# EAGLE design Stand_Alone_Inv_Adapter (EAGLE 6.2)
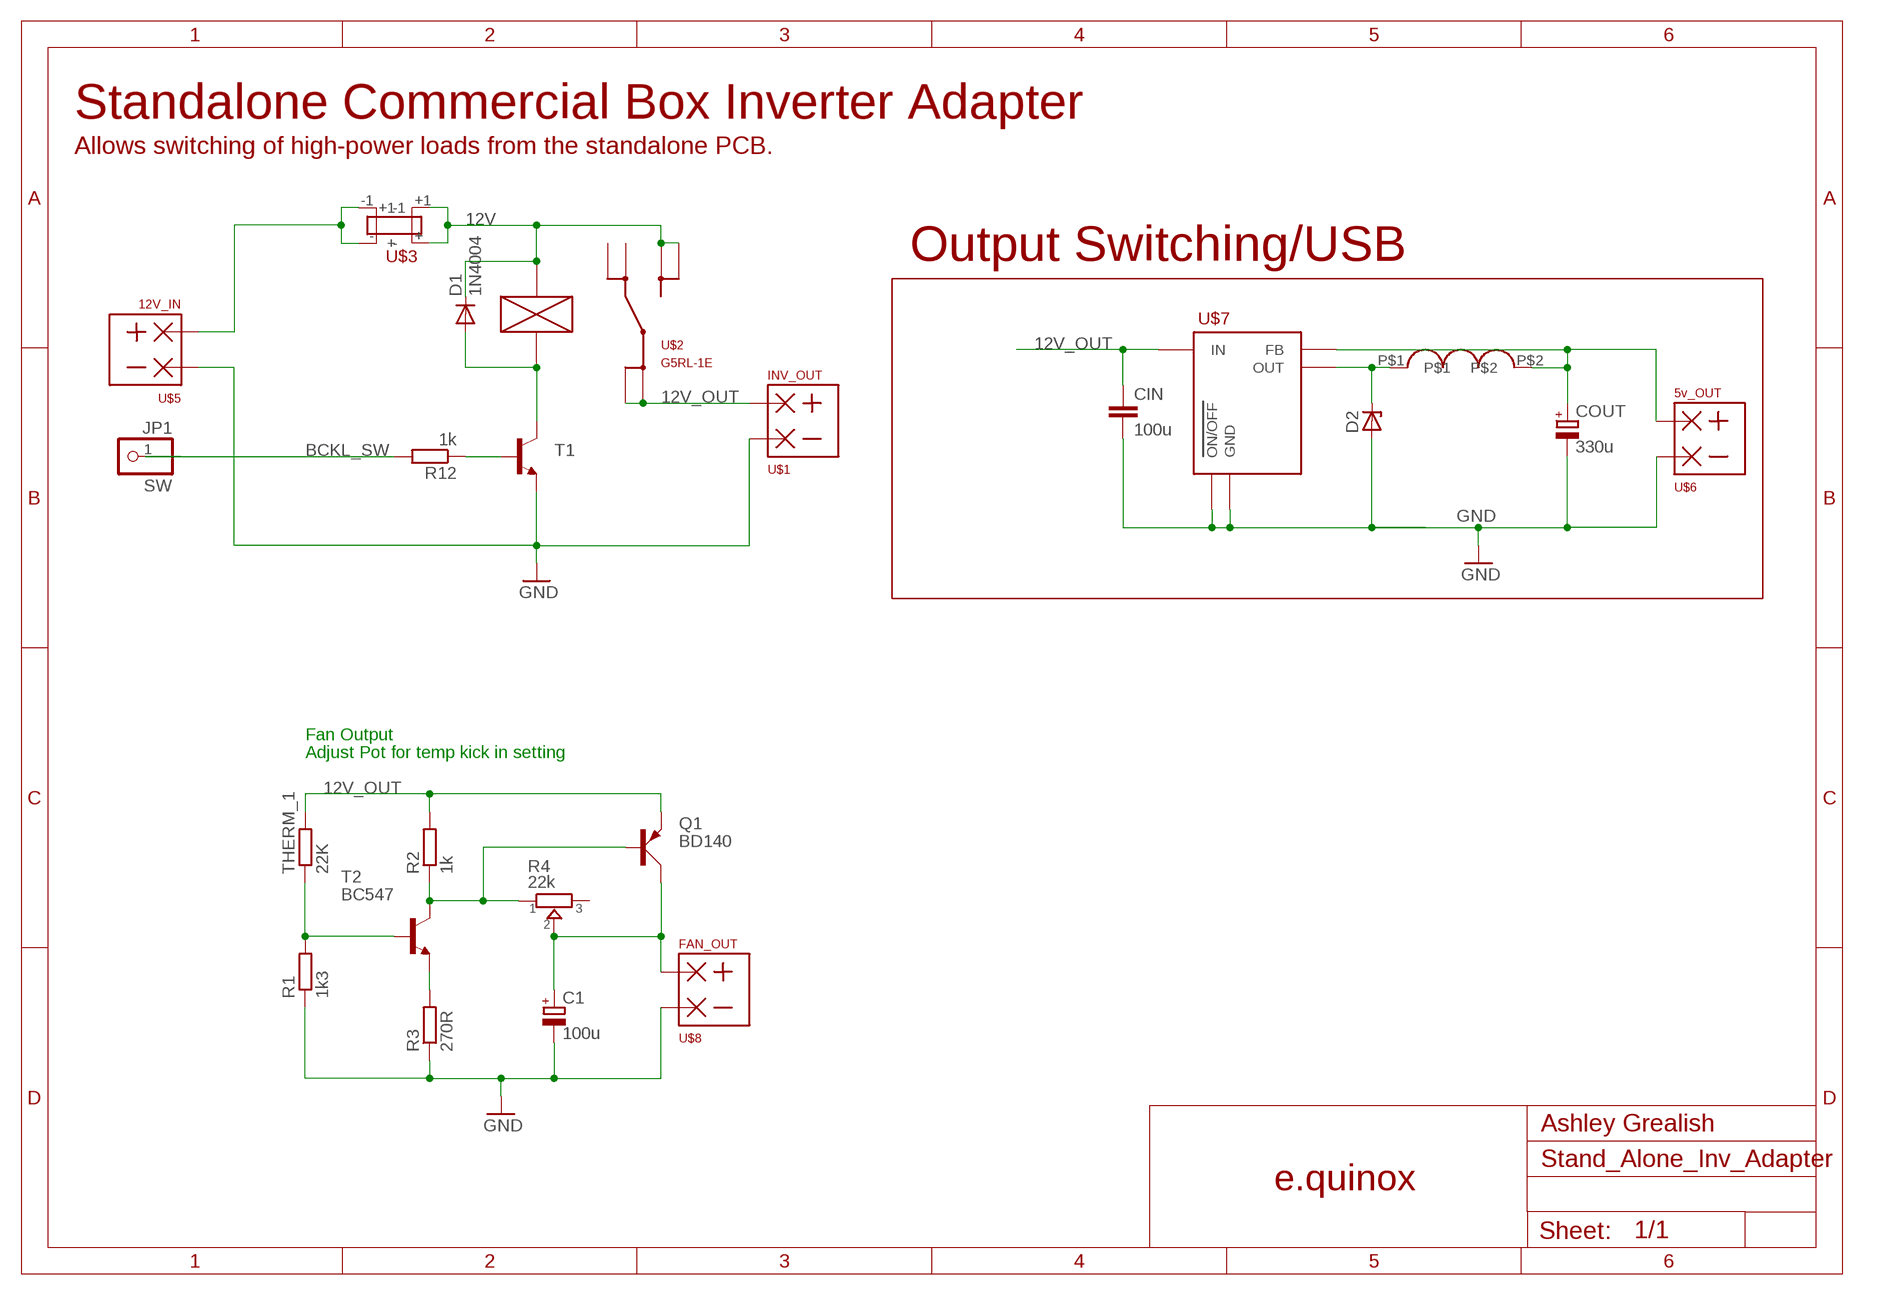
[diagram p0: schematic, sheet 1]

## Parts
C1  100u  CPOL-EUB45181B  [B45181B]
CIN  100u  C2.5/2  [C2.5-2]
COUT  330u  CPOL-EUB45181D  [B45181D]
D1  1N4004  [DO41-10]
D2  ZENER-DIODEDO41Z10  [DO41Z10]
JP1  SW  PINHD-1X1  [1X01]
Q1  BD140  [TO126AV]
R1  1k3  R-EU_0207/10  [0207/10]
R2  1k  R-EU_0207/10  [0207/10]
R3  270R  R-EU_0207/10  [0207/10]
R4  22k  TRIMMER-3362P  [TRIMMER_3362P]
R12  1k  RESISTOR-PTH-0.4  [RTH025W]
T1  BC546-NPN-TO92-CBE  [TO92-CBE]
T2  BC547  [TO92]
THERM_1  22K  R-EU_0204/7  [0204/7]
U$1  INV_OUT  TERMINAL_2WAY  [TERMINAL_2WAY]
U$2  G5RL-1E  [G5RL-1E]
U$3  EQBX_FUSEEQBX_FUSE  [EQBX_FUSE]
U$4  EQBX_INDUCTOR2  [INDUCTOR]
U$5  12V_IN  TERMINAL_2WAY  [TERMINAL_2WAY]
U$6  5v_OUT  TERMINAL_2WAY  [TERMINAL_2WAY]
U$7  LM2575  [TO220-5]
U$8  FAN_OUT  TERMINAL_2WAY  [TERMINAL_2WAY]

## Nets
12V [pow_12v]: D1.C U$2.COIL+ U$2.NO@1(NO) U$2.NO@2(NO) U$3.+ U$3.+1
12V_OUT [pow_12v]: CIN.1 Q1.E R2.2 THERM_1.2 U$1.P$1 U$2.COM@1(COM) U$2.COM@2(COM) U$7.P$1(IN)
BCKL_SW: JP1.1 R12.2
GND [pow_12v]: C1.- CIN.2 COUT.- D2.A R1.1 R3.1 T1.E U$1.P$2 U$5.P$2 U$6.P$2 U$7.P$3(GND) U$7.P$5(ON/OFF) U$8.P$2
N$1: D1.A T1.C U$2.COIL-
N$2: R12.1 T1.B
N$3 [pow_12v]: U$3.- U$3.-1 U$5.P$1
N$4: R1.2 T2.2(B) THERM_1.1
N$5: Q1.B R2.1 R4.1 T2.3(C)
N$6: R3.2 T2.1(E)
N$8: C1.+ Q1.C R4.2 U$8.P$1
N$27 [pow_5v]: COUT.+ U$4.P$2 U$6.P$1 U$7.P$4(FB)
N$30: D2.C U$4.P$1 U$7.P$2(OUT)
Unconnected: R4.3 U$2.NC@1(NC) U$2.NC@2(NC)

## Notes on the sheet
- Standalone Commercial Box Inverter Adapter
- Allows switching of high-power loads from the standalone PCB.
- Output Switching/USB
- Fan Output
- Adjust Pot for temp kick in setting
- Ashley Grealish
- e.quinox

## Library data of the parts
C1 COUT = resistor:CPOL-EU: POLARIZED CAPACITOR, European symbol
CIN = capacitor-wima:C: CAPACITOR naming: grid - package width
D1 = diode:1N4004: DIODE general purpose rectifier, 1 A
D2 = diode:ZENER-DIODE: Z-Diode
JP1 = pinhead:PINHD-1X1: PIN HEADER
Q1 = transistor-power:BD140: PNP TRANSISTOR
R1-R3 THERM_1 = resistor:R-EU_: RESISTOR, European symbol
R4 = dp_devices:TRIMMER: Trimmer resistor
R12 = dp_devices:RESISTOR
T1 = transistor:*-NPN-: NPN Transistror BF959 corrected 2008.03.06
T2 = transistor:BC547: NPN TRANSISTOR
U$1 U$5 U$6 U$8 = terminal_2way:TERMINAL_2WAY
U$2 = equinox:G5RL-1E
U$3 = eqbx_fuse:EQBX_FUSE
U$4 = inductor:EQBX_INDUCTOR2
U$7 = LM2575_TO220:LM2575

## Net classes
0 default: width 0.381 mm, drill 0.61 mm, clearance 0.381 mm
1 pow_5v: width 0.762 mm, drill 0.762 mm, clearance 0.762 mm
2 pow_12v: width 1.372 mm, drill 0.762 mm, clearance 0.762 mm
3 gnd: width 0.508 mm, drill 0.61 mm

## Board
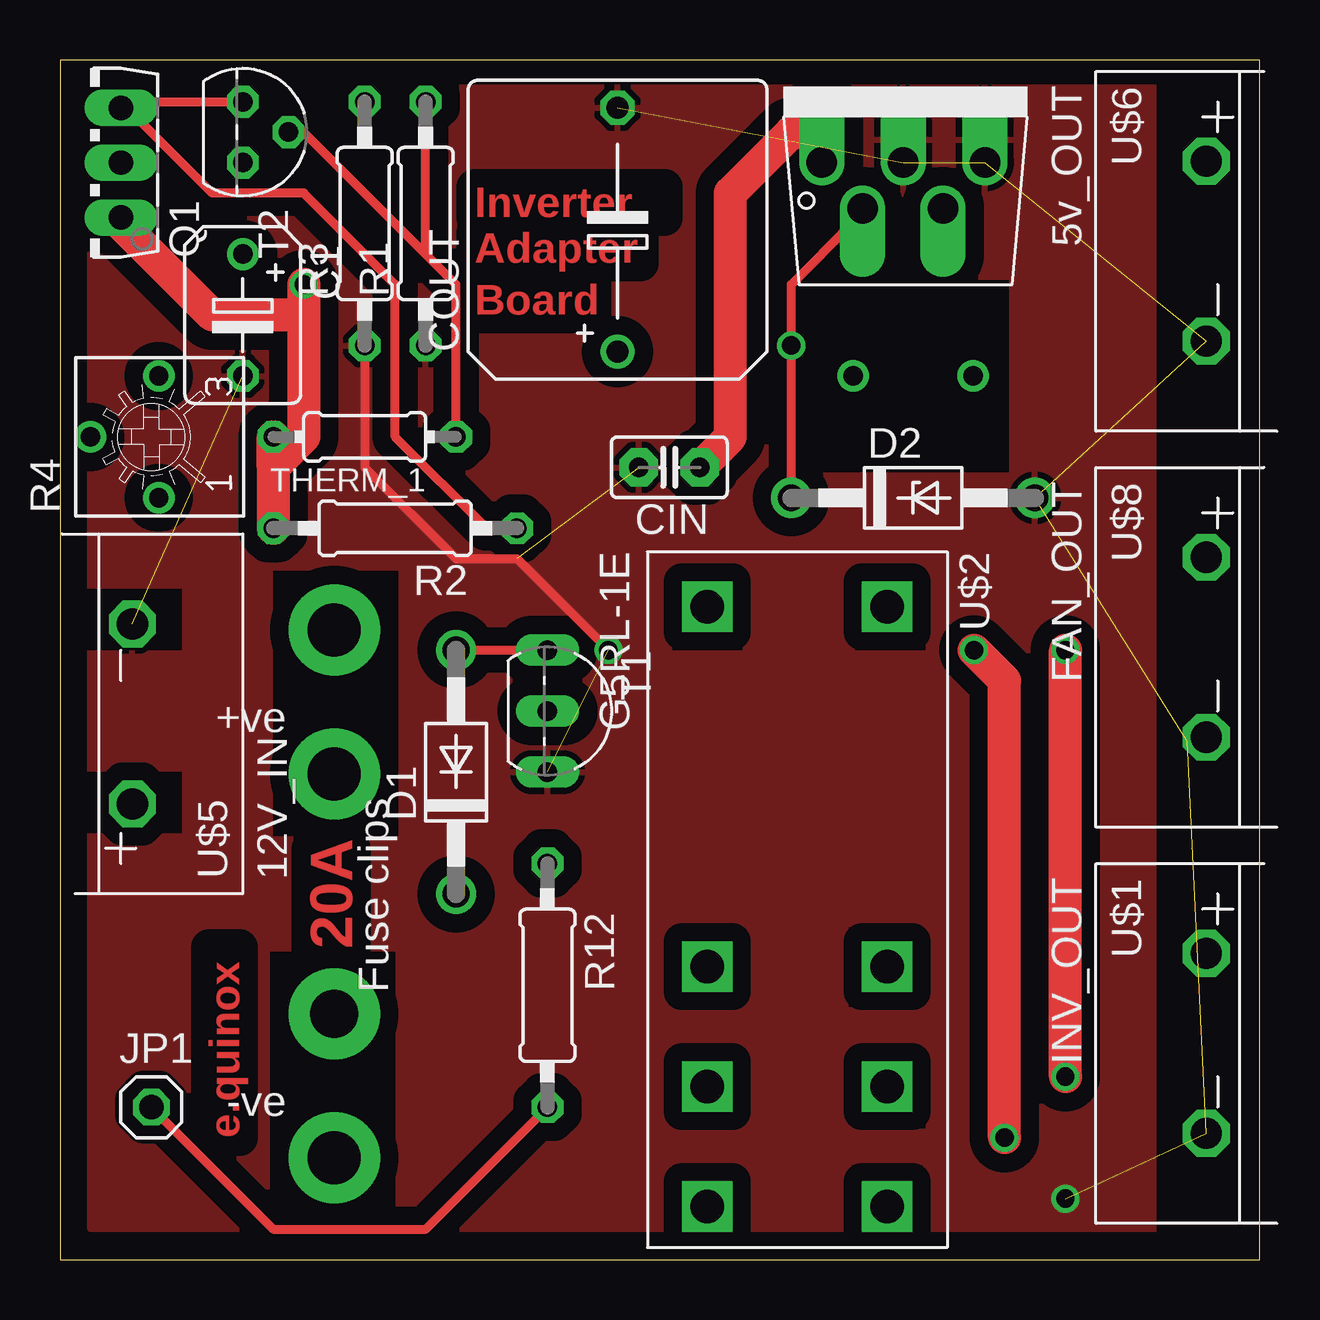
[diagram p1: board, top side]
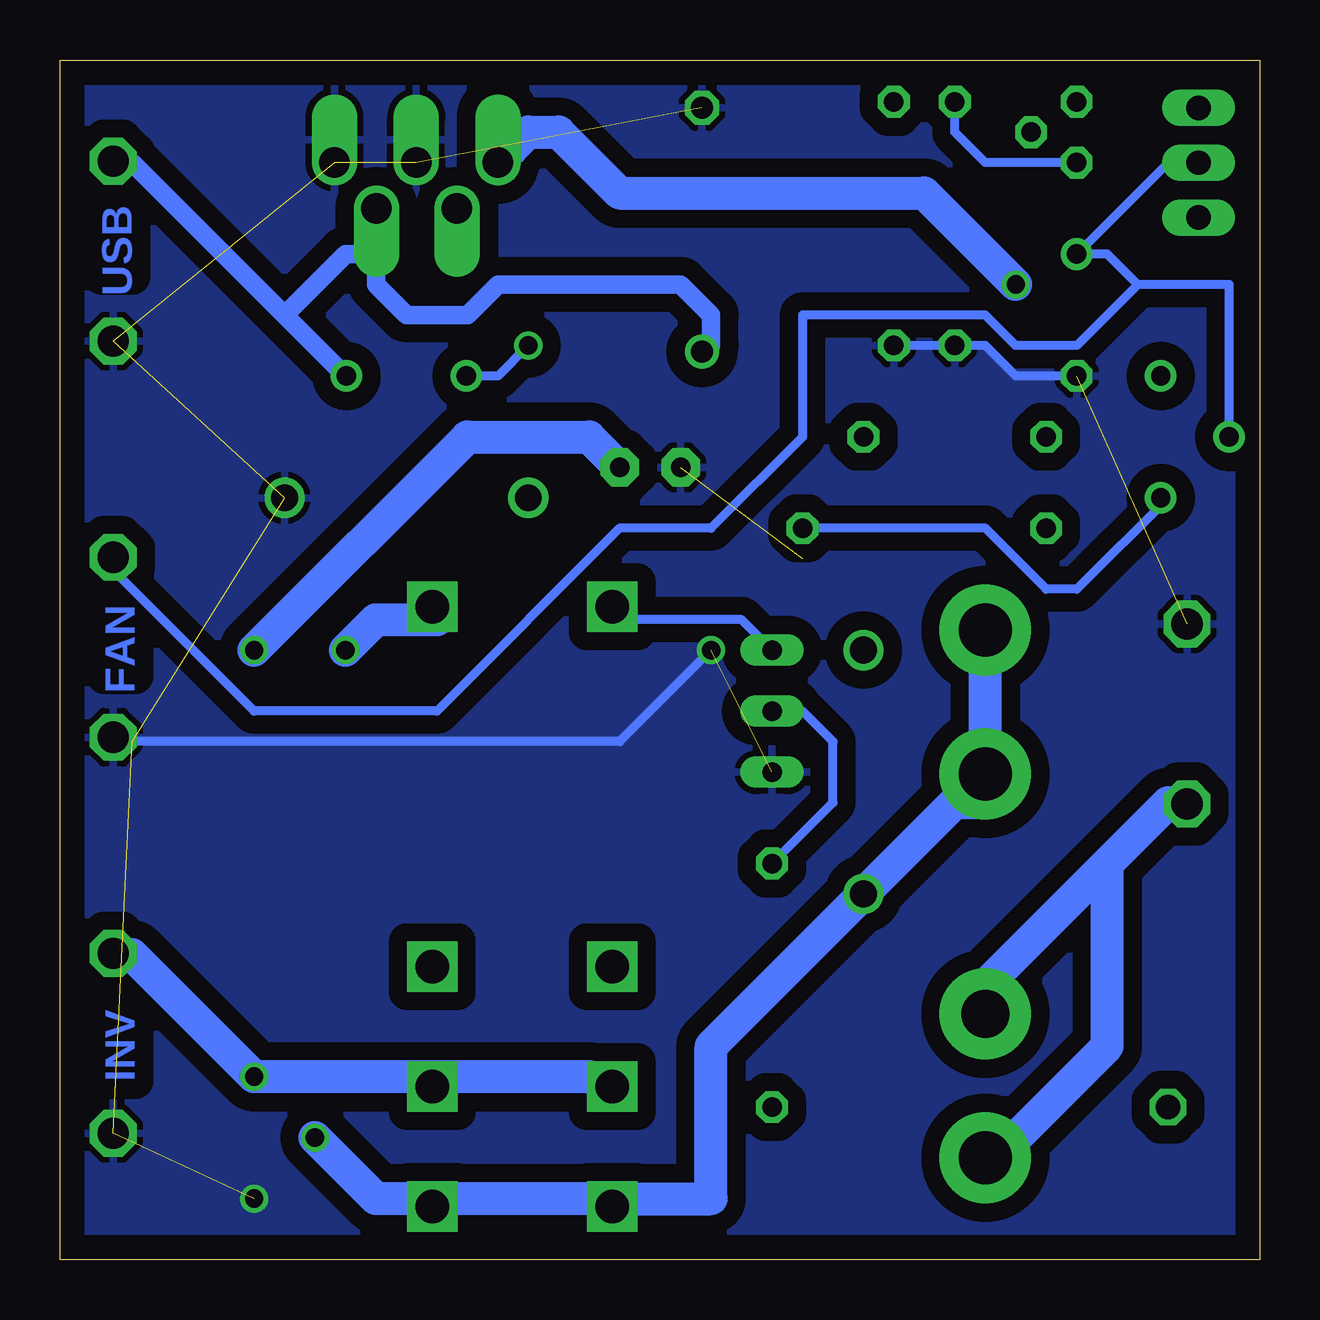
[diagram p2: board, bottom side, seen from below]

Size 50 x 50 mm. Coordinates in mm from the lower left corner, seen from the top.
Outline: 0,0 50,0 50,50 0,50 0,0
Copper layers (1*16): Top 0.035mm / dielectric 1.5mm / Bottom 0.035mm
Design rules: minimum track width 10mil, minimum drill 24mil, track to track 8mil, track to pad 8mil, pad to pad 8mil, via to via 8mil, smd to smd 8mil, copper to edge 40mil, drill to drill 8mil, minimum pad ring 10mil, minimum via ring 8mil, stop-mask expansion 4mil, vias tented up to drill 0mil, thermal gap 10mil
tRestrict: area 45.7,-1.3 to 50.8,50.8; area 1.3,17.8 to 5.1,20.3; area 1.3,17.8 to 5.1,20.3; area 1.3,25.4 to 5.1,27.9; area 8.9,17.7 to 14.1,28.7; area 8.8,1.8 to 14,12.8; area 25.5,25.4 to 28.4,28.7; area 33.1,25.4 to 36.1,28.7; area 25.5,10.5 to 28.4,13.8; area 25.5,5.6 to 28.4,8.9; area 25.5,0.5 to 28.4,3.8; area 33,0.6 to 35.9,3.9; 2 more areas

### Footprints (pad centres in the part's own frame; a part is rotated, then mirrored left to right if it is on the bottom)
B45181B = drill 0.813: + -2.54,0 | drill 0.813 octagon: - 2.54,0
C2.5-2 = drill 0.813 pad 1.6 octagon: 1 -1.27,0; 2 1.27,0
B45181D = drill 0.914: + -5.08,0 | drill 0.914 octagon: - 5.08,0
DO41-10 = drill 1.118: A 5.08,0; C -5.08,0
DO41Z10 = drill 1.118: A 5.08,0; C -5.08,0
1X01 = drill 1.016 octagon: 1 0,0
TO126AV = drill 1.016 long: B 2.286,-1.27; C 0,-1.27; E -2.286,-1.27
0207/10 = drill 0.813 octagon: 1 -5.08,0; 2 5.08,0
TRIMMER_3362P = drill 0.8: 1 -2.54,-0.31; 2 0,2.54; 3 2.54,-0.31
RTH025W = drill 0.813 octagon: 1 -5.08,0; 2 5.08,0
TO92-CBE = drill 0.813 long: B 0,0; C -2.54,0; E 2.54,0
TO92 = drill 0.813 octagon: 1 1.27,0; 2 0,1.905; 3 -1.27,0
0204/7 = drill 0.813 octagon: 1 -3.81,0; 2 3.81,0
TERMINAL_2WAY = drill 1.3 octagon: P$1 3.75,4.6; P$2 11.25,4.6
G5RL-1E = drill 1.4 square: COIL+ -10.7,4; COIL- -10.7,-3.5; COM@1 9.3,4; COM@2 9.3,-3.5; NC@1 4.3,4; NC@2 4.3,-3.5; NO@1 14.3,4; NO@2 14.3,-3.5
EQBX_FUSE = drill 2.2 pad 3.81: + 0,-5; +1 0,-11; -1 0,11 | drill 2 pad 3.81: - 0,5
INDUCTOR = drill 0.8: P$1 2.5,0; P$2 -2.5,0
TO220-5 = drill 1.27 offset: P$1 0,0; P$2 1.702,-1.905; P$3 3.404,0; P$4 5.055,-1.905; P$5 6.807,0

### Placement (x,y rotation side)
C1  7.62,39.37 270 top
CIN  25.4,33.02 180 top
COUT  23.24,42.93 90 top
D1  16.51,20.32 90 top
D2  35.56,31.75 0 top
JP1  3.81,6.35 0 top
Q1  1.27,45.72 90 top
R1  15.24,43.18 90 top
R2  13.97,30.48 180 top
R3  12.7,43.18 90 top
R4  3.81,34.29 90 top
R12  20.32,11.43 270 top
T1  20.32,22.86 270 top
T2  7.62,46.99 270 top
THERM_1  12.7,34.29 180 top
U$1  43.18,16.51 270 top
U$2  30.48,16.51 270 top
U$3  11.43,15.24 180 top
U$4  35.56,36.83 180 top
U$5  7.62,15.24 90 top
U$6  43.18,49.53 270 top
U$7  31.75,45.72 0 top
U$8  43.18,33.02 270 top

### Tracks (layer width: path | path; a pad name or v marks a point on that pad's centre or on a via)
12V  (via drill 0.76)
  Top 1.372: v38.1,25.4 39.37,24.13 v39.37,5.08
  Bottom 1.372: U$3.+1 U$3.+ 11.43,19.05 12.7,19.05 D1.C 22.86,8.89 22.86,2.54 26.67,2.54 U$2.NO@2 27.94,2.54 34.29,2.54 | v38.1,25.4 36.83,26.67 34.29,26.67 U$2.COIL+ | v39.37,5.08 36.83,2.54 34.29,2.54 | 34.29,2.54 U$2.NO@1
12V_OUT  (via drill 0.76)
  Top 1.372: 8.89,33.02 THERM_1.2 | 8.89,33.02 R2.2 | 10.16,39.37 6.35,39.37 2.54,43.18 Q1.E | 10.16,39.37 10.16,34.29 8.89,33.02 | CIN.1 27.94,34.29 27.94,44.45 30.48,46.99 31.75,46.99 U$7.P$1 | v10.16,40.64 10.16,39.37 | v41.91,7.62 v41.91,25.4
  Bottom 1.372: 34.29,7.62 v41.91,7.62 46.99,12.7 U$1.P$1 | 34.29,7.62 27.94,7.62 U$2.COM@2 | 34.29,7.62 U$2.COM@1 | v10.16,40.64 13.97,44.45 26.67,44.45 29.21,46.99 30.48,46.99 U$7.P$1 | v41.91,25.4 33.02,34.29 27.94,34.29 CIN.1
BCKL_SW
  Top 0.381: R12.2 15.24,1.27 8.89,1.27 JP1.1
GND  (via drill 0.76)  (10 unrouted)
  Top 0.381: v22.86,25.4 19.05,29.21 16.51,29.21 12.7,33.02 R3.1
  Bottom 0.381: C1.- 10.16,36.83 11.43,38.1 R3.1 R1.1 | v22.86,25.4 26.67,21.59 46.99,21.59 U$8.P$2
  other vias: 41.91,2.54
  pour Bottom: 0.51,0.64 49.53,0.51 49.53,49.4 0.51,49.53
  pour Top: 1.27,1.27 1.27,49.15 48.77,49.15 48.77,1.27
N$1
  Top 0.381: D1.A T1.C
  Bottom 0.381: T1.C 21.59,26.67 26.67,26.67 U$2.COIL-
N$2
  Bottom 0.381: R12.1 17.78,19.05 17.78,21.59 19.05,22.86 T1.B
N$3
  Bottom 1.372: 6.35,16.51 11.43,11.43 U$3.- | 6.35,16.51 3.81,19.05 U$5.P$1 | 6.35,16.51 6.35,8.89 10.16,5.08 U$3.-1
N$4
  Top 0.381: THERM_1.1 16.51,40.64 15.24,41.91 | 15.24,41.91 10.16,46.99 T2.2 | 15.24,41.91 R1.2
N$5
  Top 0.381: 2.54,48.26 T2.3 | 2.54,48.26 Q1.B | 2.54,48.26 6.35,44.45 10.16,44.45 13.97,40.64 13.97,34.29 17.78,30.48 R2.1
  Bottom 0.381: R2.1 11.43,30.48 8.89,27.94 7.62,27.94 3.81,31.75 R4.1
N$6
  Bottom 0.381: T2.1 11.43,45.72 12.7,46.99 R3.2
N$8
  Bottom 0.381: R4.2 1.27,40.64 5.08,40.64 | 5.08,40.64 6.35,41.91 C1.+ 3.81,45.72 Q1.C | 5.08,40.64 7.62,38.1 10.16,38.1 11.43,39.37 19.05,39.37 19.05,34.29 22.86,30.48 26.67,30.48 34.29,22.86 41.91,22.86 48.26,29.21 U$8.P$1
N$27
  Bottom 0.762: 40.64,39.37 46.99,45.72 U$6.P$1 | 40.64,39.37 38.1,36.83 U$4.P$2 | 36.83,41.91 36.83,43.18 U$7.P$4 36.83,41.91 | 36.83,41.91 36.83,40.64 35.56,39.37 33.02,39.37 31.75,40.64 24.13,40.64 22.86,39.37 22.86,38.1 COUT.+ | 40.64,39.37 38.1,41.91 36.83,41.91
N$30  (via drill 0.76)
  Top 0.381: D2.C v30.48,38.1 30.48,40.64 33.02,43.18 U$7.P$2
  Bottom 0.381: v30.48,38.1 31.75,36.83 U$4.P$1

### Text on the board
Top: Inverter | Adapter | Board | 20A | e.quinox
Bottom: USB | FAN | INV